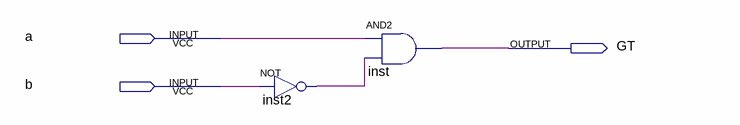
[diagram p0: schematic sheet]
// Quartus schematic Comparator.bdf as structural Verilog: 2 symbols, 3 pins
module Comparator (
  input  a,
  input  b,
  output GT
);

  wire inst2_out;

  not inst2 (inst2_out, b);
  and inst (GT, a, inst2_out);
endmodule
